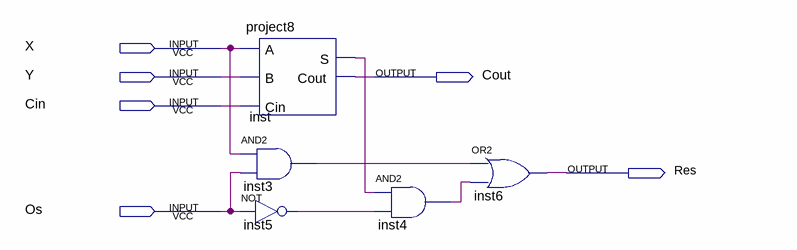
[diagram p0: schematic sheet]
// Quartus schematic division_unit.bdf as structural Verilog: 5 symbols, 6 pins
module division_unit (
  input  X,
  input  Y,
  input  Cin,
  input  Os,
  output Cout,
  output Res
);

  wire inst3_out, inst4_out, inst5_out, inst_s;

  project8 inst (.A(X), .B(Y), .Cin(Cin), .S(inst_s), .Cout(Cout));
  and inst3 (inst3_out, X, Os);
  not inst5 (inst5_out, Os);
  and inst4 (inst4_out, inst_s, inst5_out);
  or inst6 (Res, inst3_out, inst4_out);
endmodule
